# EAGLE design CrackberryPi_1.0.6.2_random2 (EAGLE 7.2.0)
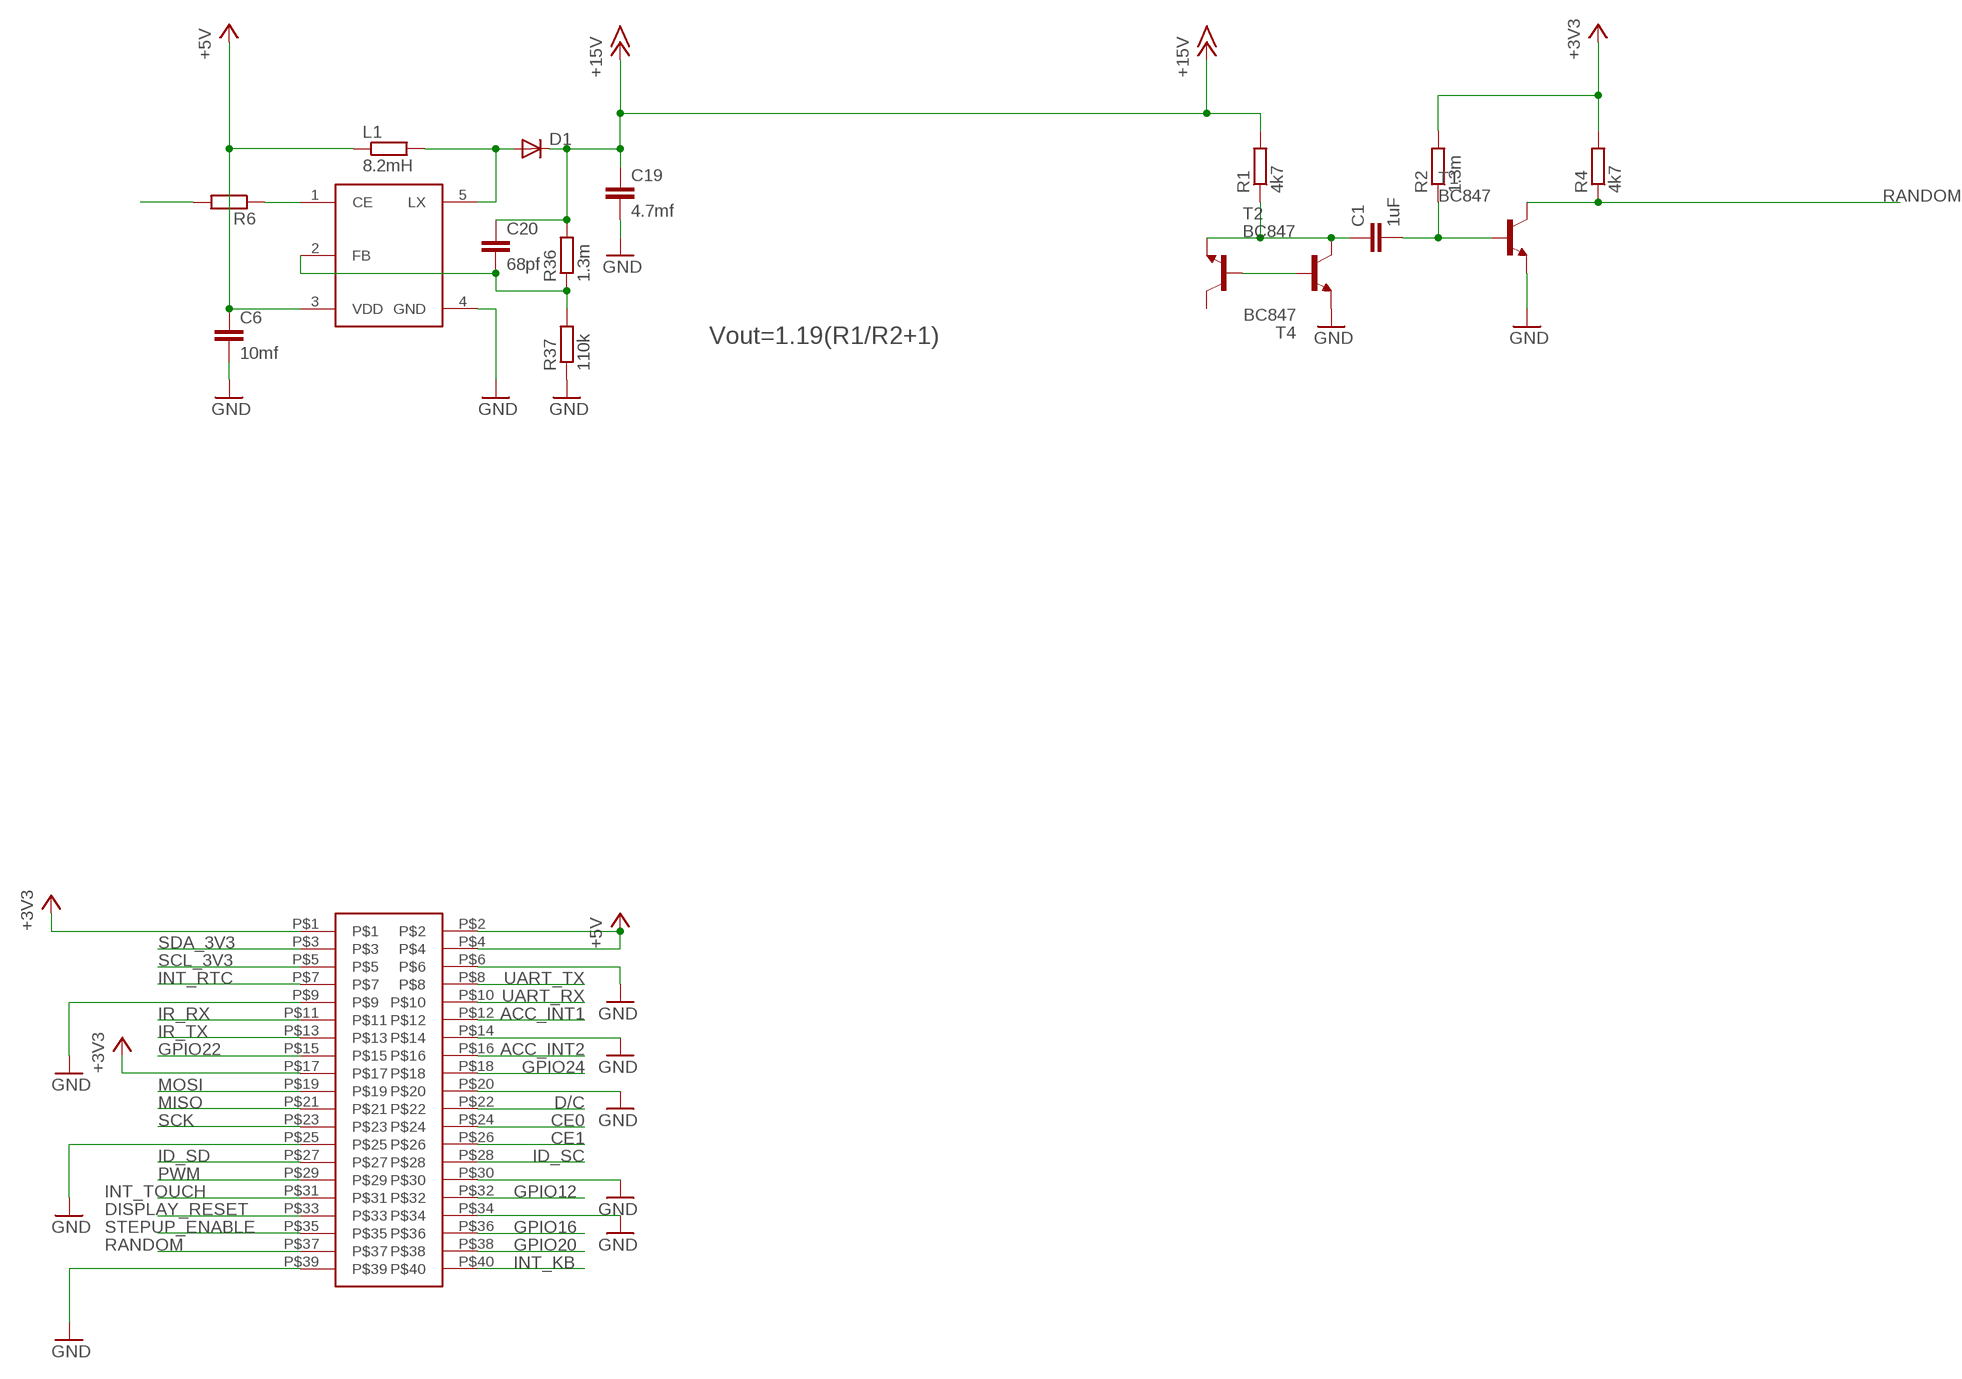
[diagram p0: schematic, sheet 1]

## Parts
C1  1uF  C-EUC0603  [C0603]
C6  10mf  C-EUC0603  [C0603]
C19  4.7mf  C-EUC0603  [C0603]
C20  68pf  C-EUC0603  [C0603]
D1  DIODE-SOD123  [SOD123]
L1  8.2mH  R-EU_R1210  [R1210]
R1  4k7  R-EU_R0603  [R0603]
R2  1.3m  R-EU_R0603  [R0603]
R4  4k7  R-EU_R0603  [R0603]
R6  R-EU_R1210  [R1210]
R36  1.3m  R-EU_R0603  [R0603]
R37  110k  R-EU_R0603  [R0603]
T1  BC847  [SOT23]
T2  BC847  [SOT23]
T4  BC847  [SOT23]
U$2  NCP1406  [SOT23-5L]
U$11  HEADER  [20X2]

## Nets
+3V3: R2.2 R4.2 U$11.P$1 U$11.P$17
+5V: C6.1 L1.1 U$2.3(VDD) U$11.P$2 U$11.P$4
+15V: C19.1 C20.1 D1.C R1.2 R36.2
ACC_INT1: U$11.P$12
ACC_INT2: U$11.P$16
CE0: U$11.P$24
CE1: U$11.P$26
D/C: U$11.P$22
DISPLAY_RESET: U$11.P$33
FB: C20.2 R36.1 R37.2 U$2.2(FB)
GND: C6.2 C19.2 R37.1 T1.2(E) T2.2(E) U$2.4(GND) U$11.P$6 U$11.P$9 U$11.P$14 U$11.P$20 U$11.P$25 U$11.P$30 U$11.P$34 U$11.P$39
GPIO12: U$11.P$32
GPIO16: U$11.P$36
GPIO20: U$11.P$38
GPIO22: U$11.P$15
GPIO24: U$11.P$18
ID_SC: U$11.P$28
ID_SD: U$11.P$27
INT_KB: U$11.P$40
INT_RTC: U$11.P$7
INT_TOUCH: U$11.P$31
IR_RX: U$11.P$11
IR_TX: U$11.P$13
LX: D1.A L1.2 U$2.5(LX)
MISO: U$11.P$21
MOSI: U$11.P$19
N$1: R6.1 U$2.1(CE)
N$2: T2.1(B) T4.1(B)
N$3: C1.1 R1.1 T2.3(C) T4.2(E)
N$4: C1.2 R2.1 T1.1(B)
PWM: U$11.P$29
RANDOM: R4.1 T1.3(C) U$11.P$37
SCK: U$11.P$23
SCL_3V3: U$11.P$5
SDA_3V3: U$11.P$3
STEPUP_ENABLE: R6.2 U$11.P$35
UART_RX: U$11.P$10
UART_TX: U$11.P$8
Unconnected: T4.3(C)

## Notes on the sheet
- Vout=1.19(R1/R2+1)

## Library data of the parts
C1 C6 C19 C20 = rcl:C-EU: CAPACITOR, European symbol
D1 = diode:DIODE-: DIODE
L1 R1 R2 R4 R6 R36 R37 = rcl:R-EU_: RESISTOR, European symbol
T1 T2 T4 = transistor:BC847: NPN TRANSISTOR
U$2 = ncp1406:NCP1406
U$11 = 20x2_cirqoid:HEADER

## Board
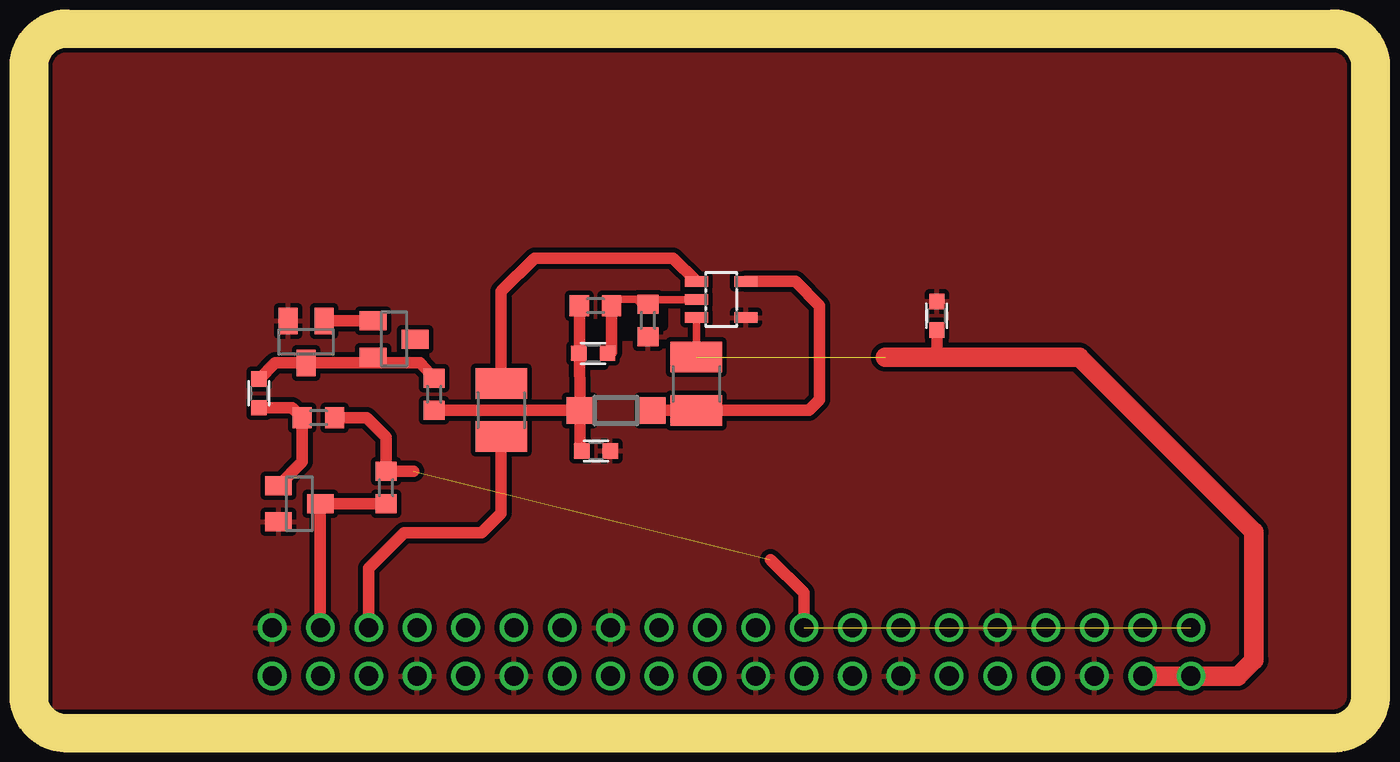
[diagram p1: board, top side]
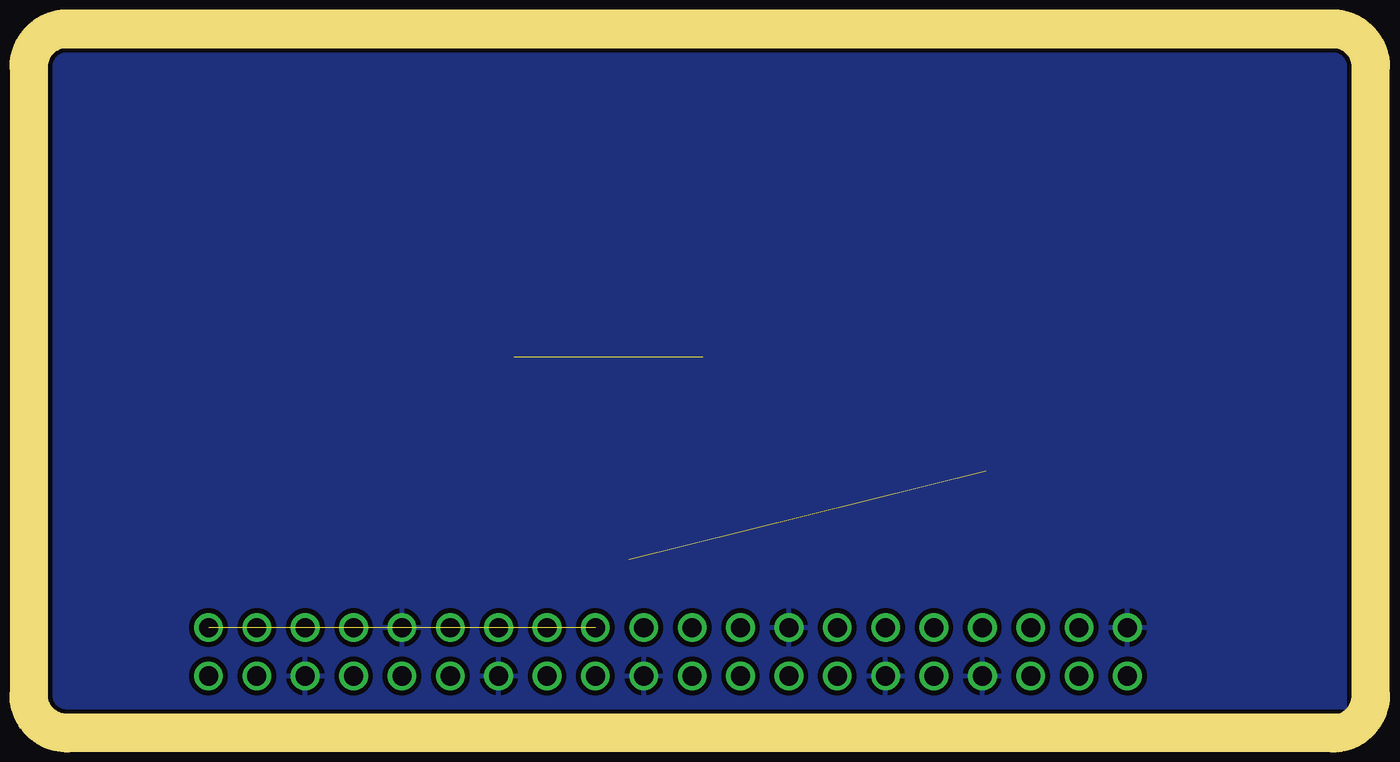
[diagram p2: board, bottom side, seen from below]

Size 68.5 x 35 mm. Coordinates in mm from the lower left corner, seen from the top.
Outline: 68.5,1 68.5,34 arc90 67.5,35 1,35 arc90 0,34 0,0 67.5,0 arc90 68.5,1
Copper layers (1*16): Top 0.035mm / dielectric 1.5mm / Bottom 0.035mm
Design rules "SeeedStudio_2layer_DRU_no_angle_20140221": minimum track width 6mil, minimum drill 12mil, track to track 6mil, track to pad 6mil, pad to pad 6mil, via to via 6mil, smd to smd 0mil, copper to edge 10mil, drill to drill 10mil, minimum pad ring 10mil, minimum via ring 6mil, stop-mask expansion 2mil, vias tented up to drill 100mil, thermal gap 10mil
tRestrict: area 28.3,19.5 to 29.2,20.5; area 30,19.9 to 31.5,21.4; area 28.4,18.3 to 29.2,19.3; area 31.5,20.4 to 32.4,21.4
Milling: 8 lines

### Footprints (pad centres in the part's own frame; a part is rotated, then mirrored left to right if it is on the bottom)
C0603 = smd 0.8 x 0.8: 1 -0.75,0; 2 0.75,0
SOD123 = smd 1.4 x 1.4: A 1.9,0; C -1.9,0
R1210 = smd 1.6 x 2.7: 1 -1.4,0; 2 1.4,0
R0603 = smd 1 x 1.1: 1 -0.85,0; 2 0.85,0
SOT23 = smd 1 x 1.4: 1 -0.95,-1.1; 2 0.95,-1.1; 3 0,1.1
SOT23-5L = smd 0.55 x 1.2: 1 -0.95,-1.3; 2 0,-1.3; 3 0.95,-1.3; 4 0.95,1.3; 5 -0.95,1.3
20X2 = drill 1: P$1 0,0; P$2 0,2.54; P$3 2.54,0; P$4 2.54,2.54; P$5 5.08,0; P$6 5.08,2.54; P$7 7.62,0; P$8 7.62,2.54; P$9 10.16,0; P$10 10.16,2.54; P$11 12.7,0; P$12 12.7,2.54; P$13 15.24,0; P$14 15.24,2.54; P$15 17.78,0; P$16 17.78,2.54; P$17 20.32,0; P$18 20.32,2.54; P$19 22.86,0; P$20 22.86,2.54; P$21 25.4,0; P$22 25.4,2.54; P$23 27.94,0; P$24 27.94,2.54; P$25 30.48,0; P$26 30.48,2.54; P$27 33.02,0; P$28 33.02,2.54; P$29 35.56,0; P$30 35.56,2.54; P$31 38.1,0; P$32 38.1,2.54; P$33 40.64,0; P$34 40.64,2.54; P$35 43.18,0; P$36 43.18,2.54; P$37 45.72,0; P$38 45.72,2.54; P$39 48.26,0; P$40 48.26,2.54

### Placement (x,y rotation side)
C1  11.1,16.85 270 top
C6  46.7,20.93 90 top
C19  28.8,13.82 0 top
C20  28.65,18.95 0 top
D1  29.85,15.95 0 top
L1  34.08,17.35 270 top
R1  20.3,16.8 270 top
R2  14.22,15.57 0 top
R4  17.77,11.9 90 top
R6  23.82,15.97 270 top
R36  28.77,21.45 180 top
R37  31.52,20.68 90 top
T1  13.22,11.05 270 top
T2  13.57,19.55 180 top
T4  18.2,19.7 270 top
U$2  35.38,21.77 270 top
U$11  60.05,4.55 180 top

### Tracks (layer width: path | path; a pad name or v marks a point on that pad's centre or on a via)
+3V3  (2 unrouted)
  Top 0.61: R2.2 16.75,15.57 17.77,14.55 R4.2 19.23,12.75 | 37.98,8.12 39.73,6.37 U$11.P$17
+5V  (1 unrouted)
  Top 0.406: U$2.3 L1.1
  Top 0.61: C6.1 46.7,18.75 | 44.05,18.8 44,18.75
  Top 1.016: U$11.P$4 U$11.P$2 62.51,2.01 63.35,2.85 63.35,9.57 54.17,18.75 46.7,18.75 44,18.75
+15V
  Top 0.61: 27.93,19.45 R36.2 | C20.1 27.93,19.45 | 27.93,19.45 D1.C | R1.2 D1.C | C19.1 27.95,13.97 D1.C
FB
  Top 0.406: U$2.2 31.77,21.77 R37.2 31.2,21.52 30.93,21.8 30.05,21.8 R36.1
  Top 0.61: C20.2 29.62,19 R36.1
GND
  pour Top (isolate 0.254, rank 6): 68.62,1.13 68.62,34.12 arc90 67.75,35 1,35 arc90 0,34 0,1 arc90 1,0 67.5,0 arc90
  pour Bottom (isolate 0.254): 68.53,1.03 68.53,33.95 arc90 67.47,35 4.03,35 4.03,34.95 0.91,34.95 arc90 0,34.04 0,1 arc90 1,0 67.5,0 arc90
LX
  Top 0.61: D1.A L1.2 39.98,15.95 40.55,16.52 40.55,21.45 39.27,22.73 U$2.5
N$1
  Top 0.61: R6.1 23.82,22.2 25.57,23.95 32.85,23.95 U$2.1
N$2
  Top 0.61: T2.1 T4.1
N$3
  Top 0.61: 17.1,18.45 T2.3 11.95,18.45 C1.1 | 17.1,18.45 19.55,18.45 R1.1 | T4.2 17.1,18.45
N$4
  Top 0.61: C1.2 12.85,16.1 R2.1 13.38,13.25 T1.1
RANDOM
  Top 0.61: U$11.P$37 T1.3 R4.1
STEPUP_ENABLE
  Top 0.61: U$11.P$35 16.87,7.67 18.73,9.53 22.8,9.53 23.82,10.55 R6.2